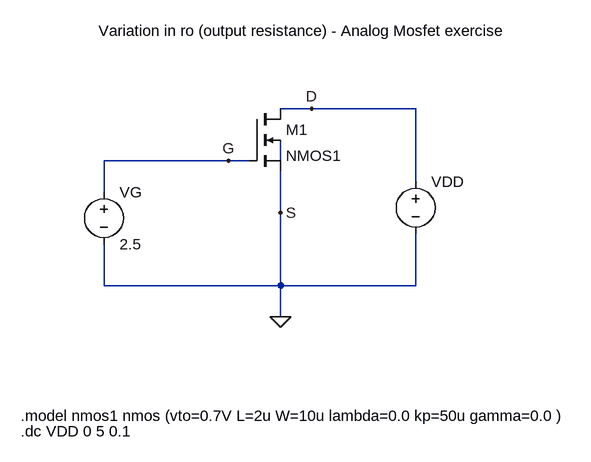
[diagram p0: schematic Variation in ro (mosfet).asc]
Variation in ro (mosfet).asc, the LTspice schematic file:
Version 4
SHEET 1 880 680
WIRE 224 96 176 96
WIRE 384 96 224 96
WIRE 96 176 -96 176
WIRE 128 176 96 176
WIRE 176 176 176 144
WIRE 384 208 384 96
WIRE -96 224 -96 176
WIRE 176 256 176 192
WIRE -96 368 -96 304
WIRE 176 368 176 256
WIRE 176 368 -96 368
WIRE 384 368 384 288
WIRE 384 368 176 368
WIRE 176 416 176 368
FLAG 176 416 0
FLAG 96 176 G
FLAG 224 96 D
FLAG 176 256 S
SYMBOL nmos4 128 96 R0
SYMATTR InstName M1
SYMATTR Value NMOS1
SYMBOL voltage -96 208 R0
WINDOW 123 0 0 Left 0
WINDOW 39 0 0 Left 0
SYMATTR InstName VG
SYMATTR Value 2.5
SYMBOL voltage 384 192 R0
WINDOW 123 0 0 Left 0
WINDOW 39 0 0 Left 0
SYMATTR InstName VDD
SYMATTR Value ""
TEXT -104 -24 Left 2 !Variation in ro (output resistance) - Analog Mosfet exercise
TEXT -224 568 Left 2 !.model nmos1 nmos (vto=0.7V L=2u W=10u lambda=0.0 kp=50u gamma=0.0 )
TEXT -224 592 Left 2 !.dc VDD 0 5 0.1

The netlist it stands for:
* Variation in ro (mosfet).asc
M1 D G 0 N001 NMOS1
VG G 0 2.5
VDD D 0
.model NMOS NMOS
.model PMOS PMOS
.lib standard.mos
Variation in ro (output resistance) - Analog Mosfet exercise
.model nmos1 nmos (vto=0.7V L=2u W=10u lambda=0.0 kp=50u gamma=0.0 )
.dc VDD 0 5 0.1
.backanno
.end

* Results of the author's LTspice run, read from the files saved beside the schematic
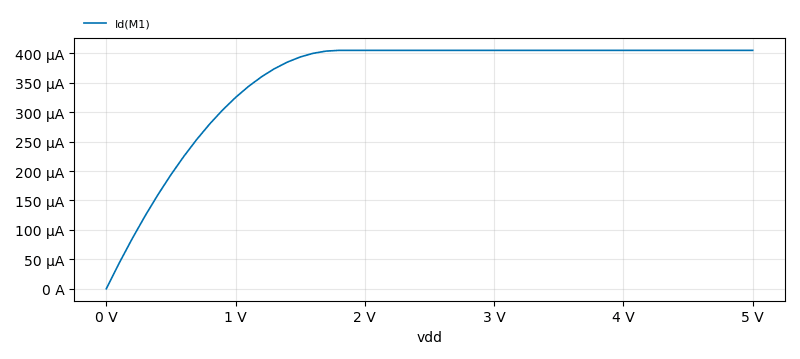
[diagram p1: DC transfer characteristic of Variation in ro (mosfet).asc, plotted from the saved traces]
* DC transfer characteristic, 1 run:
*   Id(M1): -1.322e-10 fA at vdd=0 V, 405 µA at vdd=5 V, min -1.322e-10 fA, max 405 µA